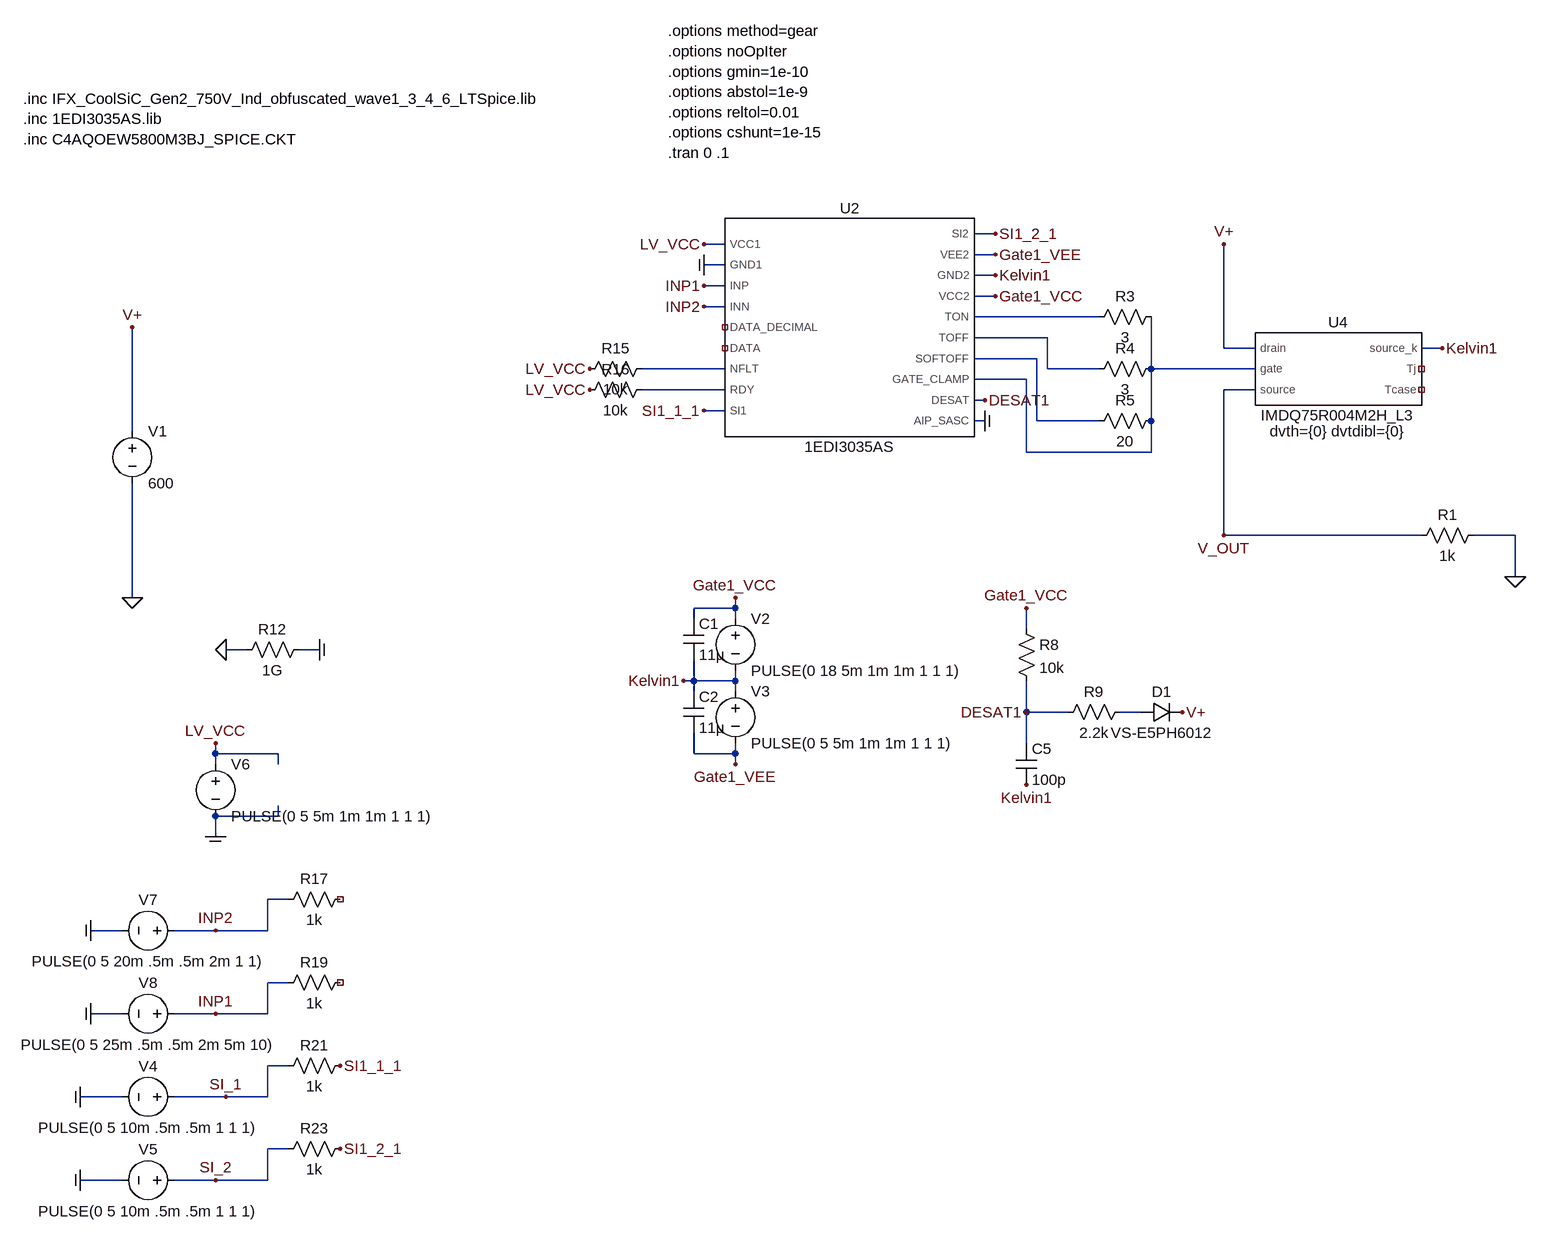
[diagram p0: schematic Gate Drive Sim_WIN.asc]
Gate Drive Sim_WIN.asc, the LTspice schematic file:
Version 4.1
SHEET 1 1448 2000
WIRE 496 -48 464 -48
WIRE 80 -32 48 -32
WIRE 496 -16 464 -16
WIRE 80 0 48 0
WIRE 496 16 464 16
WIRE 80 32 48 32
WIRE 496 48 464 48
WIRE 80 64 48 64
WIRE 656 80 464 80
WIRE 576 112 464 112
WIRE 848 128 848 -32
WIRE 896 128 848 128
WIRE 1184 128 1152 128
WIRE 560 144 464 144
WIRE 80 160 -48 160
WIRE 576 160 576 112
WIRE 656 160 576 160
WIRE 736 160 736 80
WIRE 896 160 736 160
WIRE 544 176 464 176
WIRE 80 192 -48 192
WIRE 896 192 848 192
WIRE 480 208 464 208
WIRE 80 224 48 224
WIRE 480 240 464 240
WIRE 560 240 560 144
WIRE 656 240 560 240
WIRE 736 240 736 160
WIRE -832 256 -832 96
WIRE 544 288 544 176
WIRE 736 288 736 240
WIRE 736 288 544 288
WIRE 848 416 848 192
WIRE 1152 416 848 416
WIRE 1296 416 1232 416
WIRE 1296 480 1296 416
WIRE -832 512 -832 336
WIRE 96 528 96 512
WIRE 96 528 32 528
WIRE 32 544 32 528
WIRE 96 544 96 528
WIRE 544 560 544 528
WIRE -656 592 -688 592
WIRE -544 592 -576 592
WIRE 32 640 32 608
WIRE 32 640 16 640
WIRE 96 640 96 624
WIRE 96 640 32 640
WIRE 32 656 32 640
WIRE 96 656 96 640
WIRE 544 688 544 640
WIRE 608 688 544 688
WIRE 720 688 688 688
WIRE 544 736 544 688
WIRE -704 752 -704 736
WIRE -608 752 -704 752
WIRE 32 752 32 720
WIRE 96 752 96 736
WIRE 96 752 32 752
WIRE -704 768 -704 752
WIRE -608 768 -608 752
WIRE 96 768 96 752
WIRE -608 848 -608 832
WIRE -608 848 -704 848
WIRE -704 880 -704 848
WIRE -592 976 -624 976
WIRE -848 1024 -896 1024
WIRE -704 1024 -768 1024
WIRE -624 1024 -624 976
WIRE -624 1024 -704 1024
WIRE -592 1104 -624 1104
WIRE -848 1152 -896 1152
WIRE -704 1152 -768 1152
WIRE -624 1152 -624 1104
WIRE -624 1152 -704 1152
WIRE -592 1232 -624 1232
WIRE -848 1280 -912 1280
WIRE -688 1280 -768 1280
WIRE -624 1280 -624 1232
WIRE -624 1280 -688 1280
WIRE -592 1360 -624 1360
WIRE -848 1408 -912 1408
WIRE -704 1408 -768 1408
WIRE -624 1408 -624 1360
WIRE -624 1408 -704 1408
FLAG -832 512 0
FLAG 1296 480 0
FLAG 848 -32 V+
FLAG 48 32 INP1
FLAG 48 64 INP2
FLAG 48 224 SI1_1_1
FLAG 496 -48 SI1_2_1
FLAG 1184 128 Kelvin1
FLAG 496 16 Kelvin1
FLAG 496 48 Gate1_VCC
FLAG 496 -16 Gate1_VEE
FLAG 16 640 Kelvin1
FLAG 96 512 Gate1_VCC
FLAG 96 768 Gate1_VEE
FLAG 544 528 Gate1_VCC
FLAG 544 800 Kelvin1
FLAG 784 688 V+
FLAG 480 208 DESAT1
FLAG 544 688 DESAT1
FLAG 848 416 V_OUT
FLAG 48 0 COM
FLAG -688 592 0
FLAG -544 592 COM
FLAG 48 -32 LV_VCC
FLAG -704 736 LV_VCC
FLAG -704 880 COM
FLAG -128 160 LV_VCC
FLAG -128 192 LV_VCC
FLAG -512 1232 SI1_1_1
FLAG -512 1360 SI1_2_1
FLAG -704 1024 INP2
FLAG -704 1152 INP1
FLAG -688 1280 SI_1
FLAG -704 1408 SI_2
FLAG -832 96 V+
FLAG -912 1280 COM
FLAG -912 1408 COM
FLAG 480 240 COM
FLAG -896 1024 COM
FLAG -896 1152 COM
SYMBOL voltage -832 240 R0
SYMATTR InstName V1
SYMATTR Value 600
SYMATTR SpiceLine Rser=.1 Cpar=1n
SYMBOL voltage 96 528 R0
SYMATTR InstName V2
SYMATTR Value PULSE(0 18 5m 1m 1m 1 1 1)
SYMATTR SpiceLine Rser=.1 Cpar=1n
SYMBOL voltage 96 640 R0
SYMATTR InstName V3
SYMATTR Value PULSE(0 5 5m 1m 1m 1 1 1)
SYMATTR SpiceLine Rser=.1 Cpar=1n
SYMBOL Res 752 64 R90
WINDOW 0 0 56 VBottom 2
WINDOW 3 32 56 VTop 2
SYMATTR InstName R3
SYMATTR Value 3
SYMBOL Res 752 144 R90
WINDOW 0 0 56 VBottom 2
WINDOW 3 32 56 VTop 2
SYMATTR InstName R4
SYMATTR Value 3
SYMBOL Res 752 224 R90
WINDOW 0 0 56 VBottom 2
WINDOW 3 32 56 VTop 2
SYMATTR InstName R5
SYMATTR Value 20
SYMBOL cap 16 544 R0
SYMATTR InstName C1
SYMATTR Value 11µ
SYMATTR SpiceLine Rser=10m
SYMBOL cap 16 656 R0
SYMATTR InstName C2
SYMATTR Value 11µ
SYMATTR SpiceLine Rser=10m
SYMBOL res 528 544 R0
SYMATTR InstName R8
SYMATTR Value 10k
SYMBOL res 704 672 R90
WINDOW 0 0 56 VBottom 2
WINDOW 3 32 56 VTop 2
SYMATTR InstName R9
SYMATTR Value 2.2k
SYMBOL cap 528 736 R0
SYMATTR InstName C5
SYMATTR Value 100p
SYMATTR SpiceLine Rser=10m
SYMBOL diode 720 704 R270
WINDOW 0 32 32 VTop 2
WINDOW 3 0 32 VBottom 2
SYMATTR InstName D1
SYMATTR Value VS-E5PH6012
SYMBOL res -560 576 R90
WINDOW 0 0 56 VBottom 2
WINDOW 3 32 56 VTop 2
SYMATTR InstName R12
SYMATTR Value 1G
SYMBOL voltage -704 752 R0
SYMATTR InstName V6
SYMATTR Value PULSE(0 5 5m 1m 1m 1 1 1)
SYMATTR SpiceLine Rser=.1 Cpar=1n
SYMBOL res -32 144 R90
WINDOW 0 0 56 VBottom 2
WINDOW 3 32 56 VTop 2
SYMATTR InstName R15
SYMATTR Value 10k
SYMBOL res -32 176 R90
WINDOW 0 0 56 VBottom 2
WINDOW 3 32 56 VTop 2
SYMATTR InstName R16
SYMATTR Value 10k
SYMBOL res -496 960 R90
WINDOW 0 0 56 VBottom 2
WINDOW 3 32 56 VTop 2
SYMATTR InstName R17
SYMATTR Value 1k
SYMBOL res -496 1088 R90
WINDOW 0 0 56 VBottom 2
WINDOW 3 32 56 VTop 2
SYMATTR InstName R19
SYMATTR Value 1k
SYMBOL res -496 1216 R90
WINDOW 0 0 56 VBottom 2
WINDOW 3 32 56 VTop 2
SYMATTR InstName R21
SYMATTR Value 1k
SYMBOL res -496 1344 R90
WINDOW 0 0 56 VBottom 2
WINDOW 3 32 56 VTop 2
SYMATTR InstName R23
SYMATTR Value 1k
SYMBOL voltage -752 1280 R90
WINDOW 0 -32 56 VBottom 2
WINDOW 3 32 56 VTop 2
WINDOW 123 0 0 Left 0
SYMATTR InstName V4
SYMATTR Value PULSE(0 5 10m .5m .5m 1 1 1)
SYMATTR SpiceLine Rser=.1 Cpar=1n
SYMBOL voltage -752 1408 R90
WINDOW 0 -32 56 VBottom 2
WINDOW 3 32 56 VTop 2
WINDOW 123 0 0 Left 0
SYMATTR InstName V5
SYMATTR Value PULSE(0 5 10m .5m .5m 1 1 1)
SYMATTR SpiceLine Rser=.1 Cpar=1n
SYMBOL voltage -752 1024 R90
WINDOW 0 -32 56 VBottom 2
WINDOW 3 32 56 VTop 2
WINDOW 123 0 0 Left 0
SYMATTR InstName V7
SYMATTR Value PULSE(0 5 20m .5m .5m 2m 1 1)
SYMATTR SpiceLine Rser=.1 Cpar=1n
SYMBOL voltage -752 1152 R90
WINDOW 0 -32 56 VBottom 2
WINDOW 3 32 56 VTop 2
WINDOW 123 0 0 Left 0
SYMATTR InstName V8
SYMATTR Value PULSE(0 5 25m .5m .5m 2m 5m 10)
SYMATTR SpiceLine Rser=.1 Cpar=1n
SYMBOL IMDQ75R004M2H_L3 1024 160 R0
SYMATTR InstName U4
SYMBOL res 1248 400 R90
WINDOW 0 0 56 VBottom 2
WINDOW 3 32 56 VTop 2
SYMATTR InstName R1
SYMATTR Value 1k
SYMBOL 1EDI3035AS 272 96 R0
SYMATTR InstName U2
TEXT -8 -360 Left 2 !.options method=gear\n.options noOpIter\n.options gmin=1e-10\n.options abstol=1e-9\n.options reltol=0.01\n.options cshunt=1e-15\n.tran 0 .1
TEXT -1000 -256 Left 2 !.inc IFX_CoolSiC_Gen2_750V_Ind_obfuscated_wave1_3_4_6_LTSpice.lib\n.inc 1EDI3035AS.lib\n.inc C4AQOEW5800M3BJ_SPICE.CKT

The netlist it stands for:
* Gate Drive Sim_WIN.asc
V1 V+ 0 600 Rser=.1 Cpar=1n
V2 Gate1_VCC Kelvin1 PULSE(0 18 5m 1m 1m 1 1 1) Rser=.1 Cpar=1n
V3 Kelvin1 Gate1_VEE PULSE(0 5 5m 1m 1m 1 1 1) Rser=.1 Cpar=1n
R3 N005 N001 3
R4 N005 N002 3
R5 N005 N003 20
C1 Gate1_VCC Kelvin1 11µ Rser=10m
C2 Kelvin1 Gate1_VEE 11µ Rser=10m
R8 Gate1_VCC DESAT1 10k
R9 N007 DESAT1 2.2k
C5 DESAT1 Kelvin1 100p Rser=10m
D1 N007 V+ VS-E5PH6012
R12 COM 0 1G
V6 LV_VCC COM PULSE(0 5 5m 1m 1m 1 1 1) Rser=.1 Cpar=1n
R15 N004 LV_VCC 10k
R16 N006 LV_VCC 10k
R17 NC_01 INP2 1k
R19 NC_02 INP1 1k
R21 SI1_1_1 SI_1 1k
R23 SI1_2_1 SI_2 1k
V4 SI_1 COM PULSE(0 5 10m .5m .5m 1 1 1) Rser=.1 Cpar=1n
V5 SI_2 COM PULSE(0 5 10m .5m .5m 1 1 1) Rser=.1 Cpar=1n
V7 INP2 COM PULSE(0 5 20m .5m .5m 2m 1 1) Rser=.1 Cpar=1n
V8 INP1 COM PULSE(0 5 25m .5m .5m 2m 5m 10) Rser=.1 Cpar=1n
X§U4 V+ N005 V_OUT Kelvin1 NC_03 NC_04 IMDQ75R004M2H_L3 dvth={0} dvtdibl={0}  ; pins drain gate source source_k Tj Tcase
R1 0 V_OUT 1k
X§U2 LV_VCC COM INP1 INP2 NC_05 NC_06 N004 N006 SI1_1_1 SI1_2_1 Gate1_VEE Kelvin1 Gate1_VCC N001 N002 N003 N005 DESAT1 COM 1EDI3035AS  ; pins VCC1 GND1 INP INN DATA_DECIMAL DATA NFLT RDY SI1 SI2 VEE2 GND2 VCC2 TON TOFF SOFTOFF GATE_CLAMP DESAT AIP_SASC
.model D D
.lib standard.dio
.options method=gear
.options noOpIter
.options gmin=1e-10
.options abstol=1e-9
.options reltol=0.01
.options cshunt=1e-15
.tran 0 .1
.inc IFX_CoolSiC_Gen2_750V_Ind_obfuscated_wave1_3_4_6_LTSpice.lib
.inc 1EDI3035AS.lib
.inc C4AQOEW5800M3BJ_SPICE.CKT
.lib /Users/vladroiban/Documents/Inverter/LTSpice/1EDI3035AS.lib
.backanno
.end